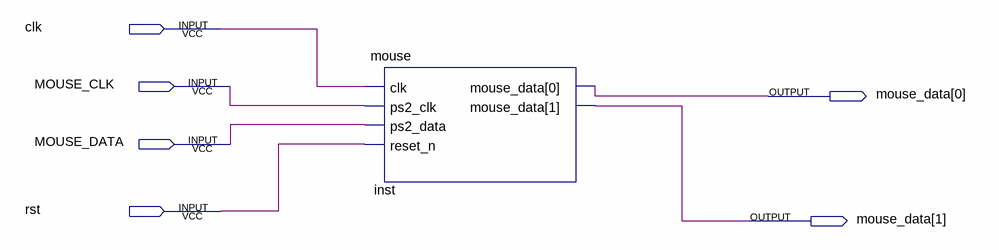
[diagram p0: schematic sheet]
// Quartus schematic teste.bdf as structural Verilog: 1 symbols, 6 pins
module teste (
  input  clk,
  input  MOUSE_CLK,
  input  MOUSE_DATA_1bit,
  input  rst,
  output [1:0] MOUSE_DATA
);

  mouse inst (.clk(clk), .ps2_clk(MOUSE_CLK), .ps2_data(MOUSE_DATA_1bit), .reset_n(rst), .mouse_data(MOUSE_DATA));
endmodule
